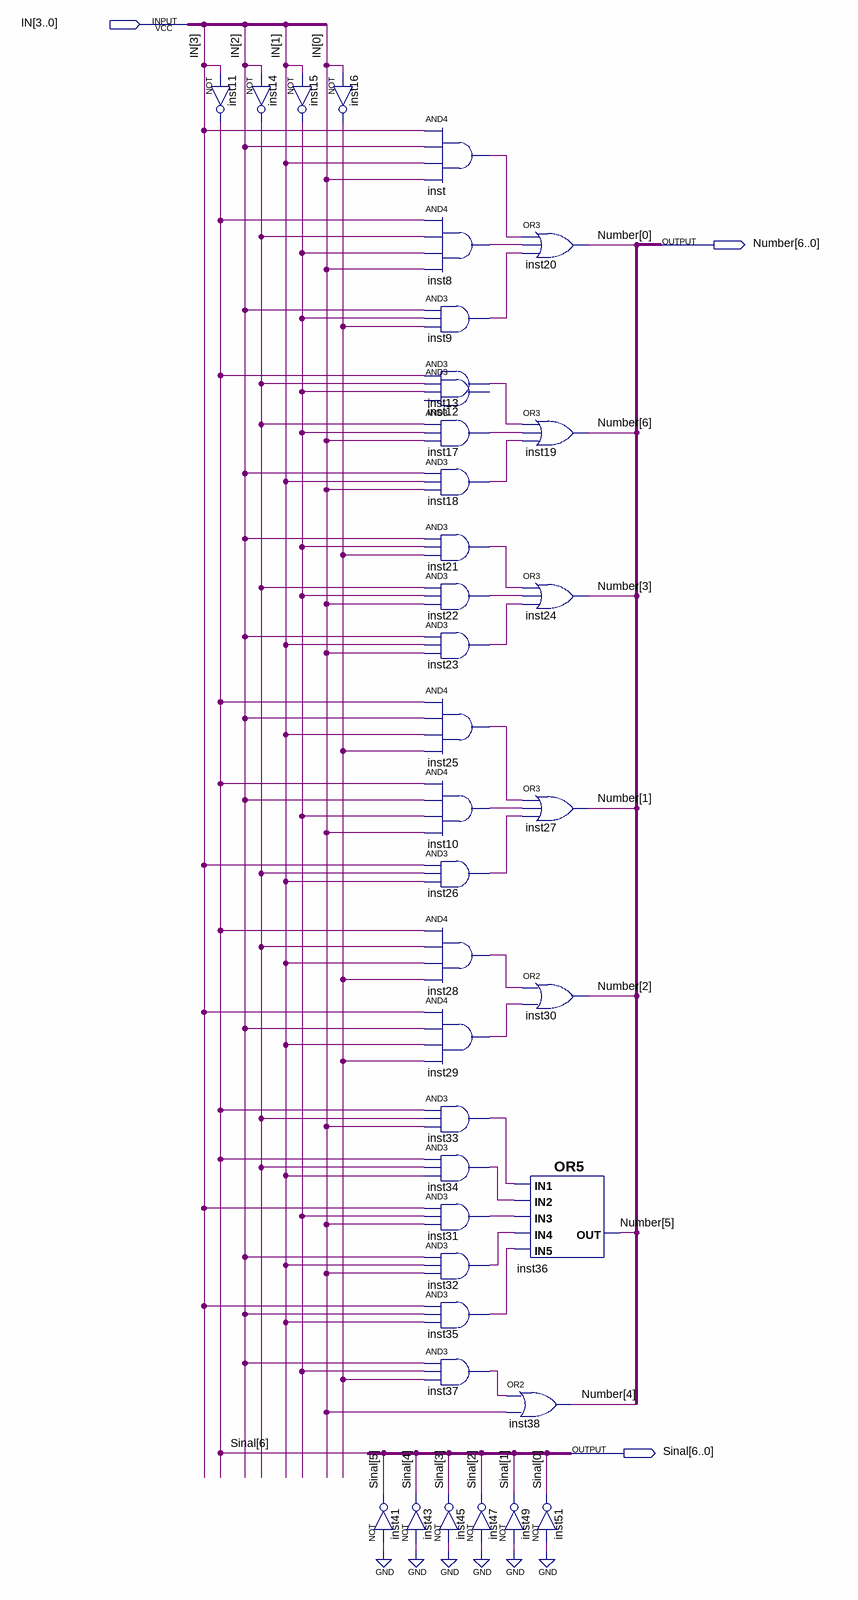
[diagram p0: schematic sheet]
// Quartus schematic display_ULA.bdf as structural Verilog: 38 symbols, 3 pins
module display_ULA (
  input  [3:0] IN,
  output [6:0] Number,
  output [6:0] Sinal
);

  wire inst8_out, inst9_out, inst10_out, inst13_out, inst14_out, inst15_out, inst16_out, inst17_out,
       inst18_out, inst21_out, inst22_out, inst23_out, inst25_out, inst26_out, inst28_out, inst29_out,
       inst31_out, inst32_out, inst33_out, inst34_out, inst35_out, inst37_out, inst_out;

  not inst11 (Sinal[6], IN[3]);
  not inst14 (inst14_out, IN[2]);
  not inst15 (inst15_out, IN[1]);
  not inst16 (inst16_out, IN[0]);
  not inst41 (Sinal[5], 1'b0);
  and inst (inst_out, IN[3], IN[2], IN[1], IN[0]);
  and inst8 (inst8_out, Sinal[6], inst14_out, inst15_out, IN[0]);
  and inst9 (inst9_out, IN[2], inst15_out, inst16_out);
  and inst13 (inst13_out, Sinal[6], inst14_out, inst15_out);
  // AND3 inst12 has open pins: IN1=inst14_out, IN2=inst15_out, IN3=open, OUT=open
  and inst17 (inst17_out, inst14_out, inst15_out, IN[0]);
  and inst18 (inst18_out, IN[2], IN[1], IN[0]);
  and inst21 (inst21_out, IN[2], inst15_out, inst16_out);
  and inst22 (inst22_out, inst14_out, inst15_out, IN[0]);
  and inst23 (inst23_out, IN[2], IN[1], IN[0]);
  and inst25 (inst25_out, Sinal[6], IN[2], IN[1], inst16_out);
  and inst10 (inst10_out, Sinal[6], IN[2], inst15_out, IN[0]);
  and inst26 (inst26_out, IN[3], inst14_out, IN[1]);
  and inst28 (inst28_out, Sinal[6], inst14_out, IN[1], inst16_out);
  and inst29 (inst29_out, IN[3], IN[2], IN[1], inst16_out);
  and inst33 (inst33_out, Sinal[6], inst14_out, IN[0]);
  and inst34 (inst34_out, Sinal[6], inst14_out, IN[1]);
  and inst31 (inst31_out, IN[3], inst15_out, IN[0]);
  and inst32 (inst32_out, IN[2], IN[1], IN[0]);
  and inst35 (inst35_out, IN[3], IN[2], IN[1]);
  and inst37 (inst37_out, IN[2], inst15_out, inst16_out);
  not inst43 (Sinal[4], 1'b0);
  not inst45 (Sinal[3], 1'b0);
  not inst47 (Sinal[2], 1'b0);
  not inst49 (Sinal[1], 1'b0);
  or inst20 (Number[0], inst_out, inst8_out, inst9_out);
  or inst19 (Number[6], inst13_out, inst17_out, inst18_out);
  or inst24 (Number[3], inst21_out, inst22_out, inst23_out);
  or inst27 (Number[1], inst25_out, inst10_out, inst26_out);
  or inst30 (Number[2], inst28_out, inst29_out);
  or inst36 (Number[5], inst33_out, inst34_out, inst31_out, inst32_out, inst35_out);
  or inst38 (Number[4], inst37_out, IN[0]);
  not inst51 (Sinal[0], 1'b0);
endmodule
